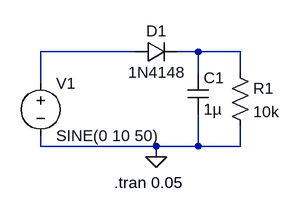
[diagram p0: schematic halfwaverectifier.asc]
halfwaverectifier.asc, the LTspice schematic file:
Version 4.1
SHEET 1 880 680
WIRE 208 64 64 64
WIRE 304 64 272 64
WIRE 368 64 304 64
WIRE 304 96 304 64
WIRE 368 96 368 64
WIRE 64 112 64 64
WIRE 64 208 64 192
WIRE 240 208 64 208
WIRE 304 208 304 160
WIRE 304 208 240 208
WIRE 368 208 368 176
WIRE 368 208 304 208
WIRE 240 224 240 208
FLAG 240 224 0
SYMBOL voltage 64 96 R0
WINDOW 123 0 0 Left 0
WINDOW 39 0 0 Left 0
SYMATTR InstName V1
SYMATTR Value SINE(0 10 50)
SYMBOL diode 208 80 R270
WINDOW 0 32 32 VTop 2
WINDOW 3 0 32 VBottom 2
SYMATTR InstName D1
SYMATTR Value 1N4148
SYMBOL res 352 80 R0
SYMATTR InstName R1
SYMATTR Value 10k
SYMBOL cap 288 96 R0
SYMATTR InstName C1
SYMATTR Value 1µ
TEXT 176 264 Left 2 !.tran 0.05

The netlist it stands for:
* halfwaverectifier.asc
V1 N001 0 SINE(0 10 50)
D1 N001 N002 1N4148
R1 N002 0 10k
C1 N002 0 1µ
.model D D
.lib standard.dio
.tran 0.05
.backanno
.end